# Altium schematic sheet POWER-USB2TTL.SchDoc
size A4; DocumentNumber: 7; SheetNumber: 7; SheetTotal: 7
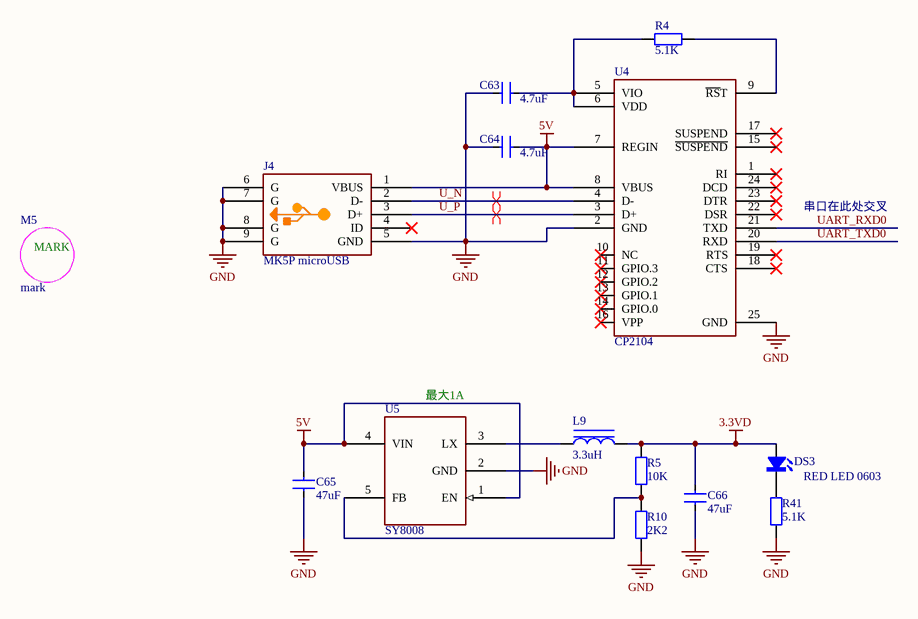
[diagram p0: POWER-USB2TTL.SchDoc]

## Parts
C63  4.7uF  [C0402]
C64  4.7uF  [C0402]
C65  47uF  [0805C]
C66  47uF  [0805C]
DS3  RED LED 0603  [LED0603]
J4  MK5P microUSB  [MICROUSB]
L9  3.3uH  [VLS3012E]
M5  mark  [ZY_UR-3X2]
R4  5.1K  [R0402]
R5  10K  [R0402]
R10  2K2  [R0402]
R41  5.1K  [R0402]
U4  CP2104  [QFN24]
U5  SY8008  [SOT23-5]

## Nets
3.3VD: C66.2 DS3.A L9.1 R5.2
5V: C64.2 C65.1 J4.1(VBUS) U4.7(REGIN) U4.8(VBUS) U5.1(EN) U5.4(VIN)
GND: C63.2 C64.1 C65.2 C66.1 J4.5(GND) J4.6(G) J4.7(G) J4.8(G) J4.9(G) R10.1 R41.2 U4.2(GND) U4.25(GND) U5.2(GND)
U_N: J4.2(D-) U4.4(D-)
U_P: J4.3(D+) U4.3(D+)
UART_RXD0: U4.21(TXD)
UART_TXD0: U4.20(RXD)
NetC63_1: C63.1 R4.1 U4.5(VIO) U4.6(VDD)
NetDS3_K: DS3.K R41.1
NetL9_2: L9.2 U5.3(LX)
NetR4_2: R4.2 U4.9(~{RS}T)
NetR5_1: R5.1 R10.2 U5.5(FB)

Not connected (* = marked no-connect by the designer): J4 4(ID)*; U4 1(RI)* 10(NC)* 11(GPIO.3)* 12(GPIO.2)* 13(GPIO.1)* 14(GPIO.0)* 15(~{SUSPEND})* 16(VPP)* 17(SUSPEND)* 18(CTS)* 19(RTS)* 22(DSR)* 23(DTR)* 24(DCD)*

## Layout directives
differential pair: U_N, U_P

## Notes on the sheet
- 串口在此处交叉
- (near U5) 最大1A
- (in symbol mark) MARK

## Library data of the parts
C63-C66 = CAP: 普通小电容
DS3 = LED: 红色0603发光二极管
J4 = MICRO_USB: 4固定脚microUSB座
L9 = L: vls3012小电感
R4 R5 R10 R41 = RES: 普通电阻